# EAGLE schematic Edin_Usher_V2_0(ERM) (EAGLE 9.6.2)
COMPANY: Unexpected Maker; DATE: 24-10-2018; DRAWN: Seon; REV: V1; TITLE: TinyPICO

## Sheet 1 of 3
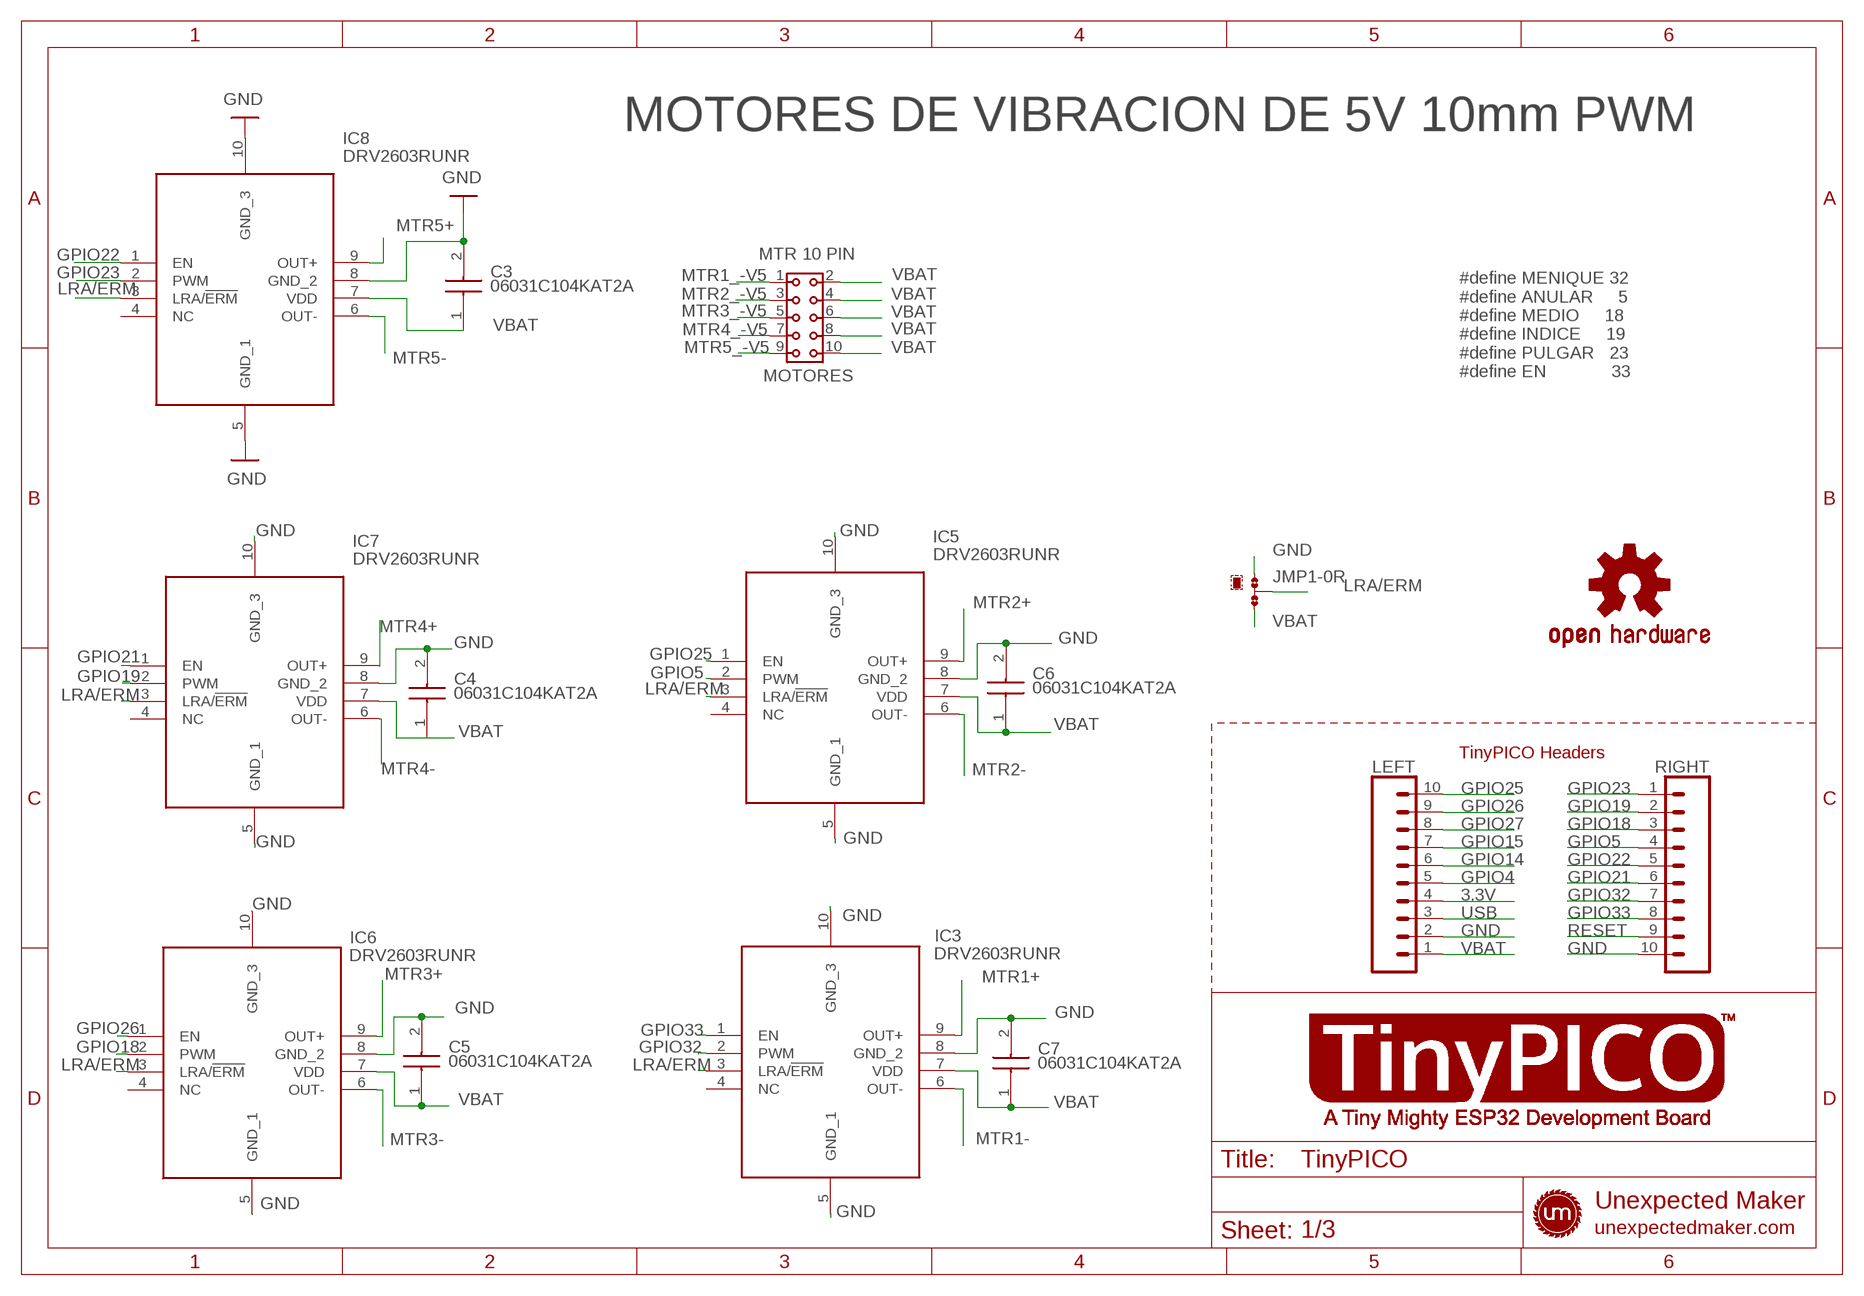
[diagram p0: schematic, sheet 1]

### Parts
C3  06031C104KAT2A  [CAPC1608X90N]
C4  06031C104KAT2A  [CAPC1608X90N]
C5  06031C104KAT2A  [CAPC1608X90N]
C6  06031C104KAT2A  [CAPC1608X90N]
C7  06031C104KAT2A  [CAPC1608X90N]
IC3  DRV2603RUNR  [QFN50P200X200X80-10N]
IC5  DRV2603RUNR  [QFN50P200X200X80-10N]
IC6  DRV2603RUNR  [QFN50P200X200X80-10N]
IC7  DRV2603RUNR  [QFN50P200X200X80-10N]
IC8  DRV2603RUNR  [QFN50P200X200X80-10N]
JMP1  0R-JUMPA  [A0R-JMP]
LEFT  TINYPICO_HEADER_10NO_SILK_PTH_FEMALE  [1X10_NO_SILK]
LOGO1  OSHW-LOGOS  [OSHW-LOGO-S]
MOTORES  MTR 10 PIN  6130XX21821_61301021821  [61301021821]
RIGHT  TINYPICO_HEADER_10NO_SILK_PTH_FEMALE  [1X10_NO_SILK]

### Nets
3.3V: LEFT.4 ; also sheet 2
GND: C3.2 C4.2 C5.2 C6.2 C7.2 IC3.5(GND_1) IC3.8(GND_2) IC3.10(GND_3) IC5.5(GND_1) IC5.8(GND_2) IC5.10(GND_3) IC6.5(GND_1) IC6.8(GND_2) IC6.10(GND_3) IC7.5(GND_1) IC7.8(GND_2) IC7.10(GND_3) IC8.5(GND_1) IC8.8(GND_2) IC8.10(GND_3) JMP1.1 LEFT.2 RIGHT.10 ; also sheet 2
GPIO4: LEFT.5 ; also sheet 2
GPIO5: IC5.2(PWM) RIGHT.4
GPIO14: LEFT.6 ; also sheet 2
GPIO15: LEFT.7 ; also sheet 2
GPIO18: IC6.2(PWM) RIGHT.3
GPIO19: IC7.2(PWM) RIGHT.2
GPIO21: IC7.1(EN) RIGHT.6
GPIO22: IC8.1(EN) RIGHT.5
GPIO23: IC8.2(PWM) RIGHT.1
GPIO25: IC5.1(EN) LEFT.10
GPIO26: IC6.1(EN) LEFT.9
GPIO27: LEFT.8 ; also sheet 2
GPIO32: IC3.2(PWM) RIGHT.7
GPIO33: IC3.1(EN) RIGHT.8
LRA/ERM: IC3.3(LRA/!ERM) IC5.3(LRA/!ERM) IC6.3(LRA/!ERM) IC7.3(LRA/!ERM) IC8.3(LRA/!ERM) JMP1.2
MTR1+: IC3.9(OUT+) ; also sheet 3
MTR1-: IC3.6(OUT-) ; also sheet 3
MTR1_-V5: MOTORES.1 ; also sheet 3
MTR2+: IC5.9(OUT+) ; also sheet 3
MTR2-: IC5.6(OUT-) ; also sheet 3
MTR2_-V5: MOTORES.3 ; also sheet 3
MTR3+: IC6.9(OUT+) ; also sheet 3
MTR3-: IC6.6(OUT-) ; also sheet 3
MTR3_-V5: MOTORES.5 ; also sheet 3
MTR4+: IC7.9(OUT+) ; also sheet 3
MTR4-: IC7.6(OUT-) ; also sheet 3
MTR4_-V5: MOTORES.7 ; also sheet 3
MTR5+: IC8.9(OUT+) ; also sheet 3
MTR5-: IC8.6(OUT-) ; also sheet 3
MTR5_-V5: MOTORES.9 ; also sheet 3
RESET: RIGHT.9 ; also sheet 2
USB: LEFT.3
VBAT: C3.1 C4.1 C5.1 C6.1 C7.1 IC3.7(VDD) IC5.7(VDD) IC6.7(VDD) IC7.7(VDD) IC8.7(VDD) JMP1.3 LEFT.1 MOTORES.2 MOTORES.4 MOTORES.6 MOTORES.8 MOTORES.10
Unconnected: IC3.4(NC) IC5.4(NC) IC6.4(NC) IC7.4(NC) IC8.4(NC)

### Notes on the sheet
- MOTORES DE VIBRACION DE 5V 10mm PWM
- #define MENIQUE 32
  #define ANULAR     5
  #define MEDIO     18
  #define INDICE     19
  #define PULGAR   23
  #define EN             33
- TinyPICO Headers

## Sheet 2 of 3: Botons
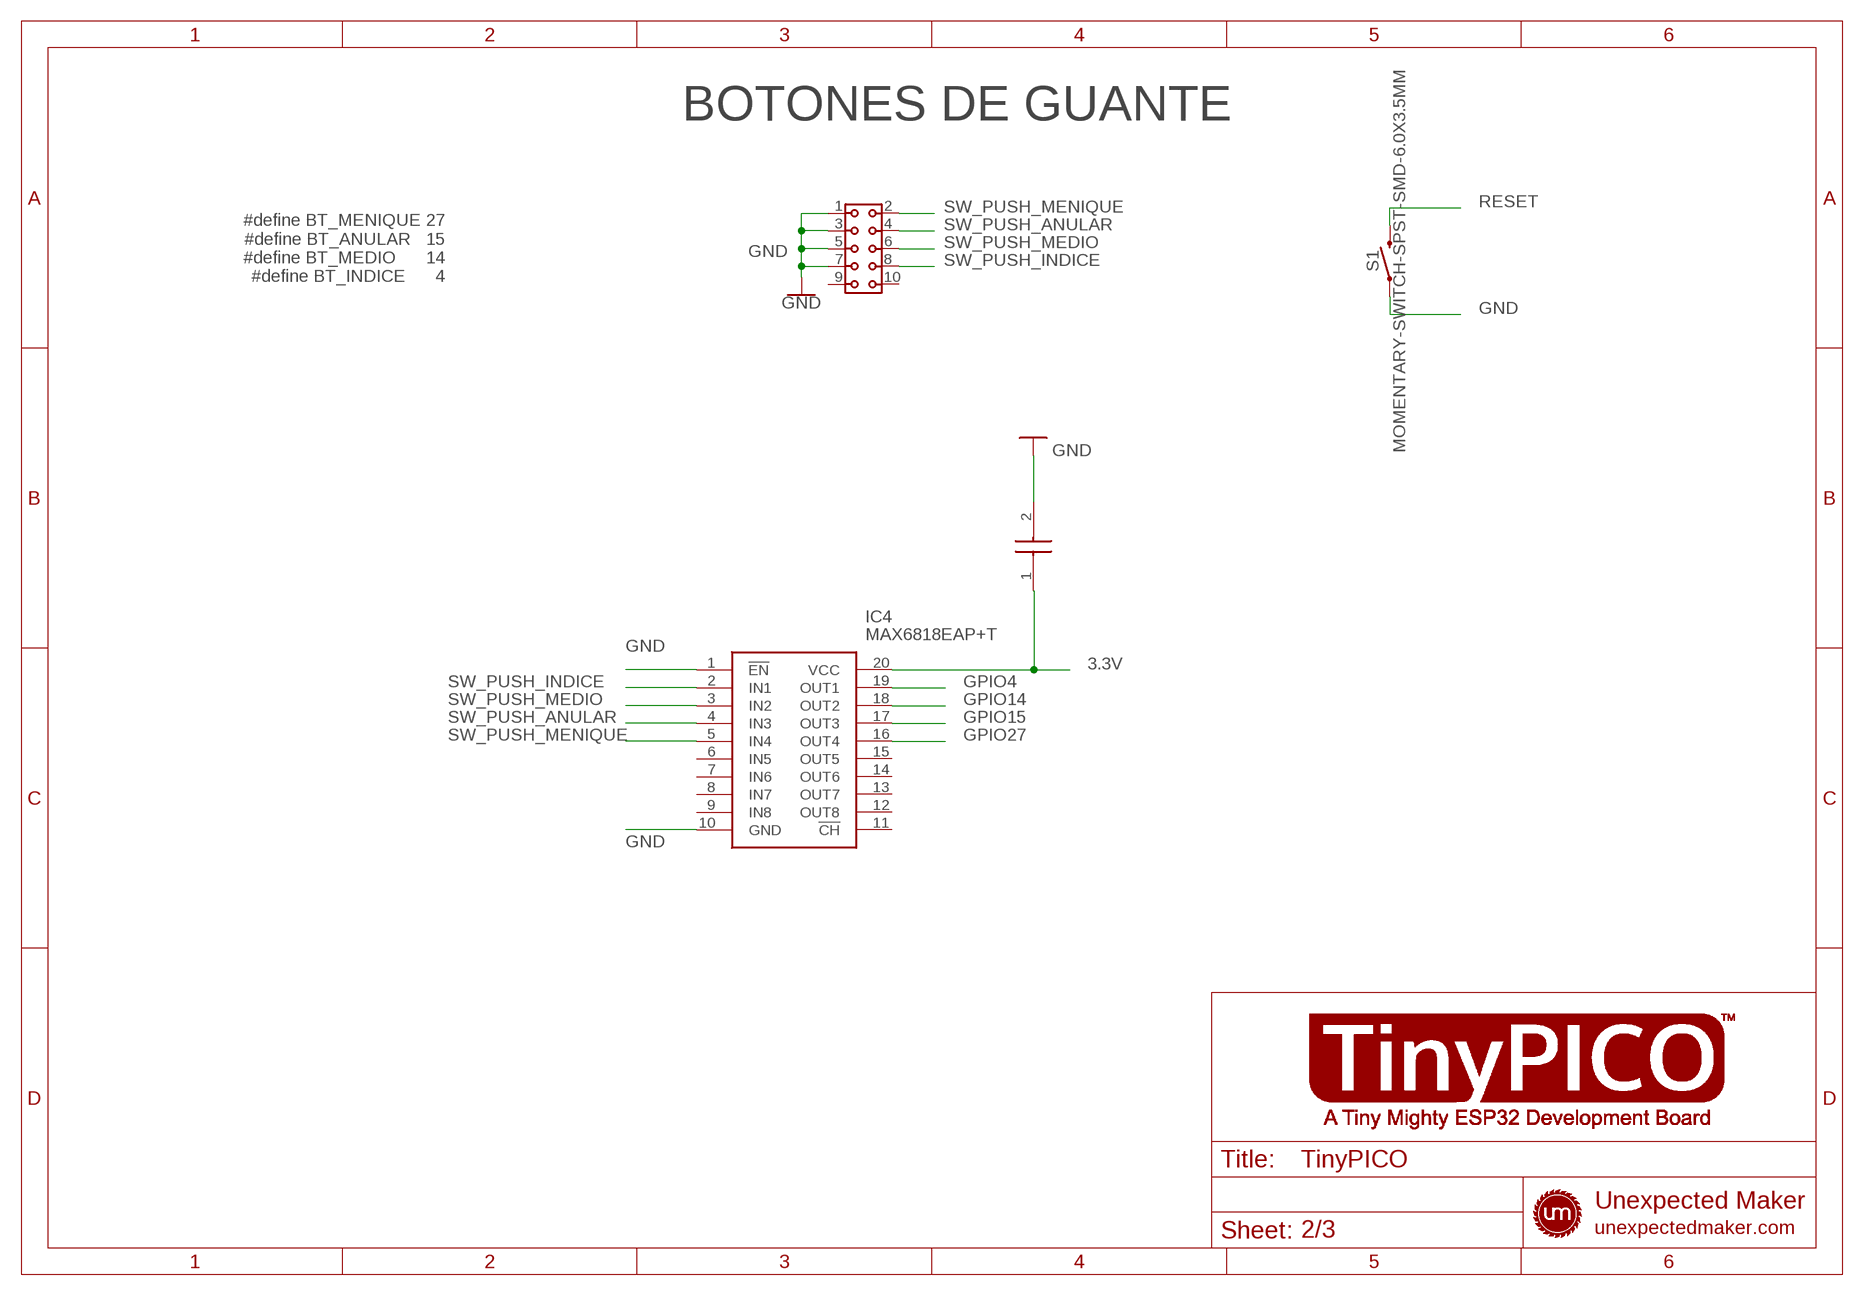
[diagram p1: schematic, sheet 2]

### Parts
BOTONES  BTN 10 PIN  6130XX21821_61301021821  [61301021821]
C8  0603B104K160CT  [CAPC1608X87N]
IC4  MAX6818EAP+T  [SOP65P778X199-20N]
S1  MOMENTARY-SWITCH-SPST-SMD-6.0X3.5MM  [TACTILE_SWITCH_SMD_6.0X3.5MM]

### Nets
3.3V: C8.1 IC4.20(VCC) ; also sheet 1
GND: BOTONES.1 BOTONES.3 BOTONES.5 BOTONES.7 C8.2 IC4.1(!EN) IC4.10(GND) S1.1 ; also sheet 1
GPIO4: IC4.19(OUT1) ; also sheet 1
GPIO14: IC4.18(OUT2) ; also sheet 1
GPIO15: IC4.17(OUT3) ; also sheet 1
GPIO27: IC4.16(OUT4) ; also sheet 1
RESET: S1.2 ; also sheet 1
SW_PUSH_ANULAR: BOTONES.4 IC4.4(IN3)
SW_PUSH_INDICE: BOTONES.8 IC4.2(IN1)
SW_PUSH_MEDIO: BOTONES.6 IC4.3(IN2)
SW_PUSH_MENIQUE: BOTONES.2 IC4.5(IN4)
Unconnected: BOTONES.9 BOTONES.10 IC4.6(IN5) IC4.7(IN6) IC4.8(IN7) IC4.9(IN8) IC4.11(!CH) IC4.12(OUT8) IC4.13(OUT7) IC4.14(OUT6) IC4.15(OUT5)

### Notes on the sheet
- BOTONES DE GUANTE
- #define BT_MENIQUE 27
  #define BT_ANULAR   15
  #define BT_MEDIO      14
  #define BT_INDICE      4

## Sheet 3 of 3
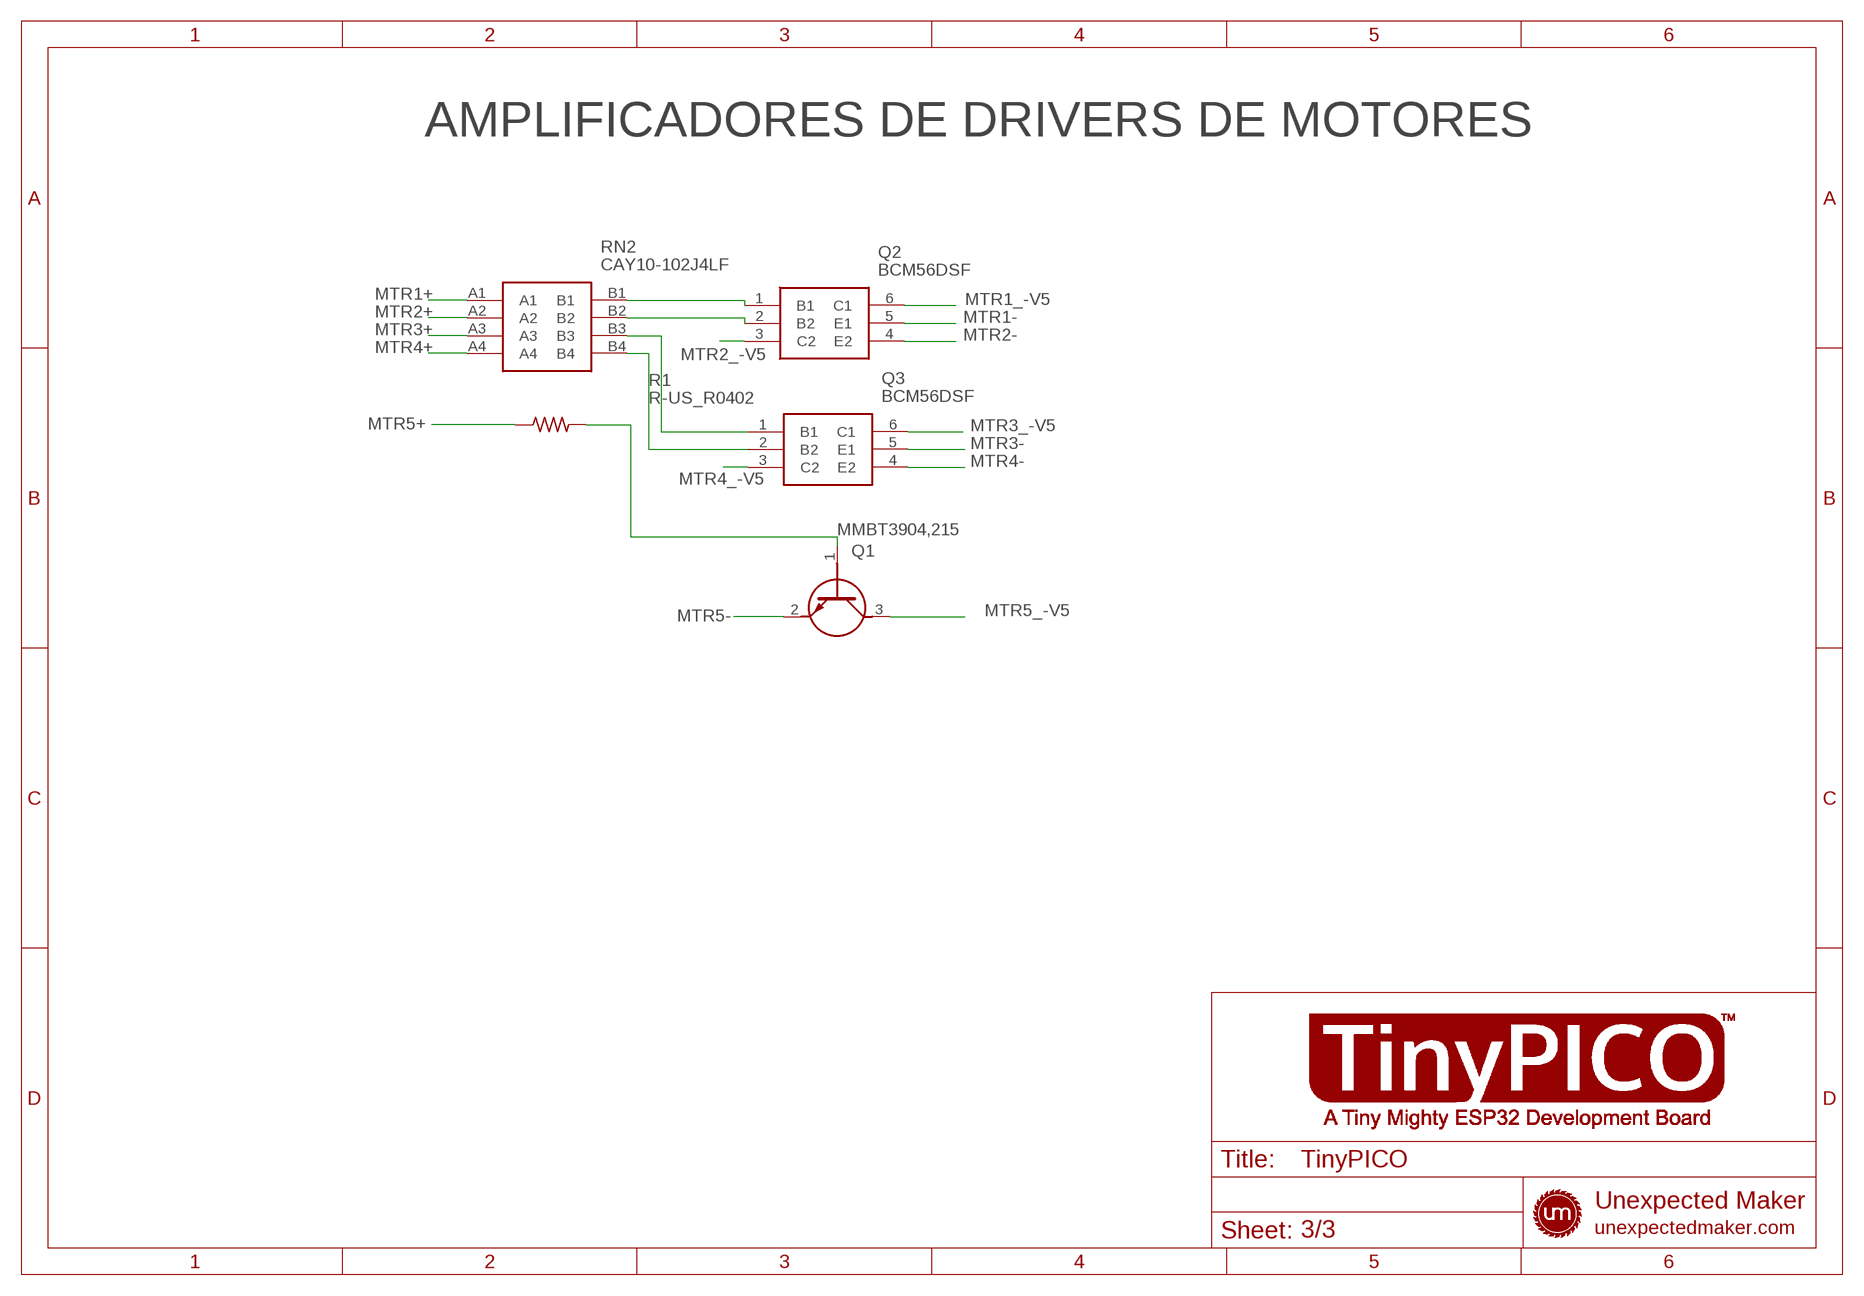
[diagram p2: schematic, sheet 3]

### Parts
Q1  MMBT3904,215  [SOT95P230X110-3N]
Q2  BCM56DSF  [SOT95P275X110-6N]
Q3  BCM56DSF  [SOT95P275X110-6N]
R1  R-US_R0402  [R0402]
RN2  CAY10-102J4LF  [CAY10102J4LF]

### Nets
MTR1+: RN2.A1 ; also sheet 1
MTR1-: Q2.5(E1) ; also sheet 1
MTR1_-V5: Q2.6(C1) ; also sheet 1
MTR2+: RN2.A2 ; also sheet 1
MTR2-: Q2.4(E2) ; also sheet 1
MTR2_-V5: Q2.3(C2) ; also sheet 1
MTR3+: RN2.A3 ; also sheet 1
MTR3-: Q3.5(E1) ; also sheet 1
MTR3_-V5: Q3.6(C1) ; also sheet 1
MTR4+: RN2.A4 ; also sheet 1
MTR4-: Q3.4(E2) ; also sheet 1
MTR4_-V5: Q3.3(C2) ; also sheet 1
MTR5+: R1.1 ; also sheet 1
MTR5-: Q1.2(E) ; also sheet 1
MTR5_-V5: Q1.3(C) ; also sheet 1
N$2: Q1.1(B) R1.2
N$6: Q2.1(B1) RN2.B1
N$7: Q2.2(B2) RN2.B2
N$8: Q3.1(B1) RN2.B3
N$9: Q3.2(B2) RN2.B4

### Notes on the sheet
- AMPLIFICADORES DE DRIVERS DE MOTORES

## Library data of the parts
BOTONES MOTORES = Wurth_Connectors_WR-PHD:6130XX21821_61301021821: WR-PHD 2.54 mm Dual Socket Header ARTICLE PROPERTIES: Pins:4;​ 6;​ 8;​ 10;​ 12;​ 14;​ 16;​ 18;​ 20;​ 22;​ 24;​ 26;​ 28;​ 30;​ 32;​ 34;​ 36;​ 40;​ 44;​ 64;​ 72 KIND PROPERTIES: Pitch：2.54 mm Quality Class:3 as per CECC 75 301-802 Rows：Dual Gender：Socket Header Type：Straight MATERIAL PROPERTIES: Insulator Material :PBT Insulator Flammability Rating:UL94 V-0 Contact Material:Copper Alloy Contact Plating:Gold Contact Type:Stamped GENERAL INFORMATION Operating Temperature:-40 up to +125 °C Compliance:Lead free / RoHS ELECTRICAL PROPERTIES: Rated Current:3 A IR 1:3 A Withstanding Voltage:500 V (AC) Contact Resistance:20 mΩ RISO:1000 MΩ CERTIFICATION UL Approval:E323964 PACKAGING PROPERTIES Packaging:Tray <https://katalog.we-online.com/media/images/v2/o57948v209%20Family_Dual_Socket_Header_WR-PHD_6130xx21821.jpg> Details see: https://katalog.we-online.com/en/em/PHD_2_54_DUAL_SOCKET_HEADER_6130XX21821 Updated by Yingchun,Shan 2019-10-21 2019 (C) Würth Elektronik; DATASHEET-URL: https://katalog.we-online.com/em/datasheet/61301021821.pdf; GENDER: Socket Header; IR: 3A; MATES: WR-PHD 2.54mm SMT Dual Pin Header/THT Angled Dual Pin Header/THT Dual Board Stacker/THT Dual Pin Header; PACKAGING: Tray; PART-NUMBER: 61301021821; PINS: 10; ROWS: Dual; TYPE: Straight
C3-C7 = SamacSys_Parts:06031C104KAT2A: AVX - 06031C104KAT2A - CAP, MLCC, X7R, 0.1UF, 100V, 0603 Source: Datasheet <https://componentsearchengine.com/Datasheets/1/06031A100FAT2A.pdf>; DESCRIPTION: AVX - 06031C104KAT2A - CAP, MLCC, X7R, 0.1UF, 100V, 0603; HEIGHT: 0.9mm; MANUFACTURER_NAME: AVX; MANUFACTURER_PART_NUMBER: 06031C104KAT2A; MOUSER_PART_NUMBER: 581-06031C104KAT2A; MOUSER_PRICE-STOCK: https://www.mouser.co.uk/ProductDetail/AVX/06031C104KAT2A?qs=oF%2FSscNnLpBUv12UcNAw2A%3D%3D
C8 = SamacSys_Parts:0603B104K160CT: WALSIN - 0603B104K160CT - CAP, 0.1F, 16V, 10%, X7R, 0603 Source: Datasheet <https://componentsearchengine.com/Datasheets/1/0603B104K160CT.pdf>; DESCRIPTION: WALSIN - 0603B104K160CT - CAP, 0.1F, 16V, 10%, X7R, 0603; HEIGHT: 0.87mm; MANUFACTURER_NAME: Walsin Technology Corporation; MANUFACTURER_PART_NUMBER: 0603B104K160CT; MOUSER_PART_NUMBER: 791-0603B104K160CT; MOUSER_PRICE-STOCK: https://www.mouser.com/Search/Refine.aspx?Keyword=791-0603B104K160CT
IC3 IC5-IC8 = SamacSys_Parts:DRV2603RUNR: Haptic Driver with Auto Resonance Tracking for LRA and Optimized Drive for ERM Source: Datasheet <http://www.ti.com/lit/gpn/drv2603>; DESCRIPTION: Haptic Driver with Auto Resonance Tracking for LRA and Optimized Drive for ERM; HEIGHT: 0.8mm; MANUFACTURER_NAME: Texas Instruments; MANUFACTURER_PART_NUMBER: DRV2603RUNR; MOUSER_PART_NUMBER: 595-DRV2603RUNR; MOUSER_PRICE-STOCK: https://www.mouser.co.uk/ProductDetail/Texas-Instruments/DRV2603RUNR?qs=l6ZoeTYLMwNhoGl8Q31%2FaA%3D%3D
IC4 = SamacSys_Parts:MAX6818EAP+T: MAXIM INTEGRATED PRODUCTS - MAX6818EAP+T. - ESD PROTE WITH SWITCH DEBOUNCER, SSOP-20 Source: Datasheet; DESCRIPTION: MAXIM INTEGRATED PRODUCTS - MAX6818EAP+T. - ESD PROTE WITH SWITCH DEBOUNCER, SSOP-20; HEIGHT: 1.99mm; MANUFACTURER_NAME: Maxim Integrated; MANUFACTURER_PART_NUMBER: MAX6818EAP+T; MOUSER_PART_NUMBER: 700-MAX6818EAPT; MOUSER_PRICE-STOCK: https://www.mouser.co.uk/ProductDetail/Maxim-Integrated/MAX6818EAP%2bT?qs=CDqwynd4ZNoKt6d34O8j%252BA%3D%3D
JMP1 = jump-0r-smd:0R-JUMP: SMD 0R 0805 Jumper
LEFT RIGHT = UnexpectedMaker:TINYPICO_HEADER_10: Multi connection point. Often used as Generic Header-pin footprint for 0.1 inch spaced/style header connections On any of the 0.1 inch spaced packages, you can populate with these: Break Away Headers - Straight <https://www.sparkfun.com/products/116> (PRT-00116) Break Away Male Headers - Right Angle <https://www.sparkfun.com/products/553> (PRT-00553) Female Headers <https://www.sparkfun.com/products/115> (PRT-00115) Break Away Headers - Machine Pin <https://www.sparkfun.com/products/117> (PRT-00117) Break Away Female Headers - Swiss Machine Pin <https://www.sparkfun.com/products/743> (PRT-00743) Arduino Stackable Header - 10 Pin <https://www.sparkfun.com/products/11376> (PRT-11376) For SCREWTERMINALS and SPRING TERMINALS visit here: Screw Terimnals on SparkFun.com <https://www.sparkfun.com/search/results?term=Screw+Terminals> (5mm/3.5mm/2.54mm spacing) This device is also useful as a general connection point to wire up your design to another part of your project. Our various solder wires solder well into these plated through hole pads. Hook-Up Wire - Assortment (Stranded, 22 AWG) <https://www.sparkfun.com/products/11375> (PRT-11375) Hook-Up Wire - Assortment (Solid Core, 22 AWG) <https://www.sparkfun.com/products/11367> (PRT-11367) View the entire wire category on our website here <https://www.sparkfun.com/categories/141> Special notes: Molex polarized connector foot print use with SKU : PRT-08231 with associated crimp pins and housings. 1MM SMD Version SKU: PRT-10208 NOTES ON THE VARIANTS LOCK and LOCK_LONGPADS... This footprint was designed to help hold the alignment of a through-hole component (i.e. 6-pin header) while soldering it into place. You may notice that each hole has been shifted either up or down by 0.005 of an inch from it's more standard position (which is a perfectly straight line). This slight alteration caused the pins (the squares in the middle) to touch the edges of the holes. Because they are alternating, it causes a "brace" to hold the component in place. 0.005 has proven to be the perfect amount of "off-center" position when using our standard breakaway headers. Although looks a little odd when you look at the bare footprint, once you have a header in there, the alteration is very hard to notice. Also,if you push a header all the way into place, it is covered up entirely on the bottom side.; PROD_ID: CONN-11563
LOGO1 = SparkFun-Aesthetics:OSHW-LOGO: Open-Source Hardware (OSHW) Logo This logo indicates the piece of hardware it is found on incorporates a OSHW license and/or adheres to the definition of open source hardware found here: http://freedomdefined.org/OSHW
Q1 = SamacSys_Parts:MMBT3904,215: MMBT3904 - NPN switching transistor Source: Datasheet <http://assets.nexperia.com/documents/data-sheet/MMBT3904.pdf>; DESCRIPTION: MMBT3904 - NPN switching transistor; HEIGHT: 1.1mm; MANUFACTURER_NAME: Nexperia; MANUFACTURER_PART_NUMBER: MMBT3904,215; MOUSER_PART_NUMBER: 771-MMBT3904T/R; MOUSER_PRICE-STOCK: https://www.mouser.co.uk/ProductDetail/Nexperia/MMBT3904215?qs=LOCUfHb8d9s%2FW6hzAJGDbw%3D%3D
Q2 Q3 = SamacSys_Parts:BCM56DSF: Trans GP BJT NPN 80V 1A 500mW Automotive 6-Pin TSOP T/R Source: Datasheet <https://componentsearchengine.com/Datasheets/1/BCM56DSF.pdf>; DESCRIPTION: Trans GP BJT NPN 80V 1A 500mW Automotive 6-Pin TSOP T/R; HEIGHT: 1.1mm; MANUFACTURER_NAME: Nexperia; MANUFACTURER_PART_NUMBER: BCM56DSF; MOUSER_PART_NUMBER: 771-BCM56DSF; MOUSER_PRICE-STOCK: https://www.mouser.com/Search/Refine.aspx?Keyword=771-BCM56DSF
R1 = audio amplifier example:R-US_: RESISTOR, American symbol
RN2 = SamacSys_Parts:CAY10-102J4LF: Bourns CAY10 Series 1k +/-5% Isolated SMT Resistor Array, 4 Resistors, 0.125W total 0804 Package Convex Source: Datasheet <https://componentsearchengine.com/Datasheets/1/CAY10-102J4LF.pdf>; DESCRIPTION: Bourns CAY10 Series 1k +/-5% Isolated SMT Resistor Array, 4 Resistors, 0.125W total 0804 Package Convex; HEIGHT: 0.45mm; MANUFACTURER_NAME: Bourns; MANUFACTURER_PART_NUMBER: CAY10-102J4LF; MOUSER_PART_NUMBER: 652-CAY10-102J4LF; MOUSER_PRICE-STOCK: https://www.mouser.co.uk/ProductDetail/Bourns/CAY10-102J4LF?qs=sGPwja4MK3eTf781t9KvQQ%3D%3D
S1 = SparkFun-Switches:MOMENTARY-SWITCH-SPST: Momentary Switch (Pushbutton) - SPST Normally-open (NO) SPST momentary switches (buttons, pushbuttons). Variants PTH-12MM - 12mm square, through-hole Momentary Pushbutton Switch - 12mm Square <https://www.sparkfun.com/products/9190> (COM-09190) PTH-6.0MM, PTH-6.0MM-KIT - 6.0mm square, through-hole Mini Pushbutton Switch <https://www.sparkfun.com/products/97> (COM-00097) KIT package intended for soldering kit's - only one side of pads' copper is exposed. PTH-RIGHT-ANGLE-KIT - Right-angle, through-hole Right Angle Tactile Button <https://www.sparkfun.com/products/10791> - Used on SparkFun BigTime Watch Kit <https://www.sparkfun.com/products/11734> SMD-12MM - 12mm square, surface-mount Tactile Button - SMD (12mm) <https://www.sparkfun.com/products/12993> (COM-12993) Used on SparkFun PicoBoard <https://www.sparkfun.com/products/11888> SMD-4.5MM - 4.5mm Square Trackball Switch Used on SparkFun Blackberry Trackballer Breakout <https://www.sparkfun.com/products/13169> SMD-4.6MMX2.8MM - 4.60mm x 2.80mm, surface mount Used on SparkFun SAMD21 Mini Breakout <https://www.sparkfun.com/products/13664> SMD-5.2MM, SMD-5.2-REDUNDANT - 5.2mm square, surface-mount Mini Pushbutton Switch - SMD <https://www.sparkfun.com/products/8720> (COM-08720) Used on Arduino Pro Mini <https://www.sparkfun.com/products/11114> REDUNDANT package connects both switch circuits together SMD-6.0X3.5MM - 6.0 x 3.5mm, surface mount Momentary Reset Switch SMD <https://www.sparkfun.com/products/8229> (COM-08229) SMD-6.2MM-TALL - 6.2mm square, surface mount Tactile Button - SMD (6mm) <https://www.sparkfun.com/products/12992> Used on SparkFun Digital Sandbox <https://www.sparkfun.com/products/12651> SMD-RIGHT-ANGLE - Right-angle, surface mount Used on SparkFun Block for Intel® Edison - Arduino <https://www.sparkfun.com/products/13036>; PROD_ID: SWCH-00815; SF_SKU: COM-08229